# Altium schematic sheet ADC_Breakout.SchDoc
size A
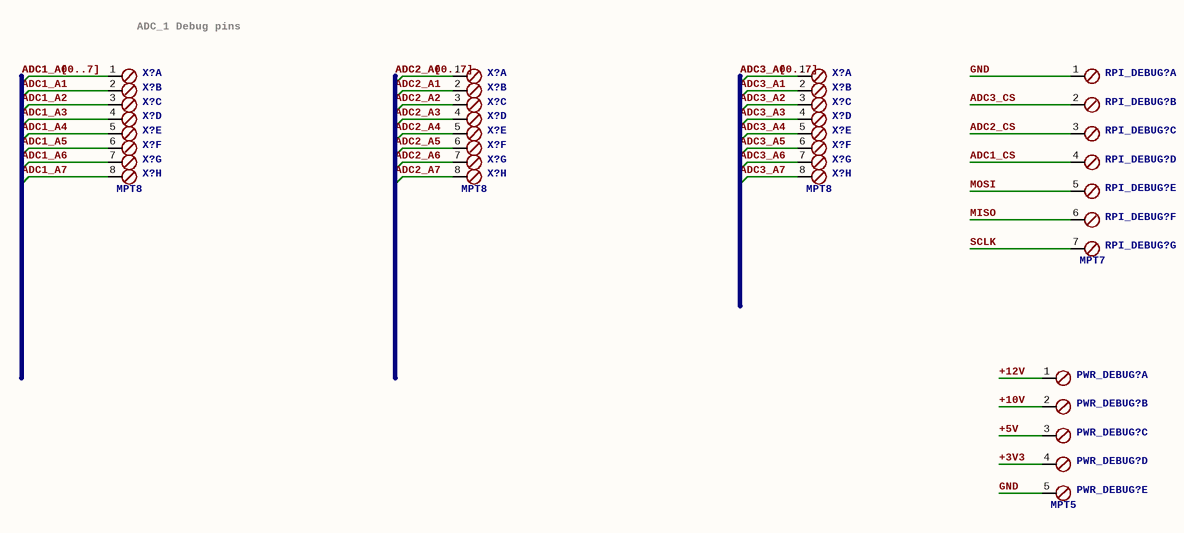
[diagram p0: ADC_Breakout.SchDoc]

## Parts
(Parts that share a designator on the sheet are numbered #1, #2 ... from top to bottom, then left to right.)
PWR_DEBUG?#1  MPT5  [5POL254]  (value not drawn)  (part A of 5)
PWR_DEBUG?#2  MPT5  [5POL254]  (value not drawn)  (part B of 5)
PWR_DEBUG?#3  MPT5  [5POL254]  (value not drawn)  (part C of 5)
PWR_DEBUG?#4  MPT5  [5POL254]  (value not drawn)  (part D of 5)
PWR_DEBUG?#5  MPT5  [5POL254]  (part E of 5)
RPI_DEBUG?#1  MPT7  [7POL254]  (value not drawn)  (part A of 7)
RPI_DEBUG?#2  MPT7  [7POL254]  (value not drawn)  (part B of 7)
RPI_DEBUG?#3  MPT7  [7POL254]  (value not drawn)  (part C of 7)
RPI_DEBUG?#4  MPT7  [7POL254]  (value not drawn)  (part D of 7)
RPI_DEBUG?#5  MPT7  [7POL254]  (value not drawn)  (part E of 7)
RPI_DEBUG?#6  MPT7  [7POL254]  (value not drawn)  (part F of 7)
RPI_DEBUG?#7  MPT7  [7POL254]  (part G of 7)
X?#1  MPT8  [8POL254]  (value not drawn)  (part A of 8)
X?#2  MPT8  [8POL254]  (value not drawn)  (part A of 8)
X?#3  MPT8  [8POL254]  (value not drawn)  (part A of 8)
X?#4  MPT8  [8POL254]  (value not drawn)  (part B of 8)
X?#5  MPT8  [8POL254]  (value not drawn)  (part B of 8)
X?#6  MPT8  [8POL254]  (value not drawn)  (part B of 8)
X?#7  MPT8  [8POL254]  (value not drawn)  (part C of 8)
X?#8  MPT8  [8POL254]  (value not drawn)  (part C of 8)
X?#9  MPT8  [8POL254]  (value not drawn)  (part C of 8)
X?#10  MPT8  [8POL254]  (value not drawn)  (part D of 8)
X?#11  MPT8  [8POL254]  (value not drawn)  (part D of 8)
X?#12  MPT8  [8POL254]  (value not drawn)  (part D of 8)
X?#13  MPT8  [8POL254]  (value not drawn)  (part E of 8)
X?#14  MPT8  [8POL254]  (value not drawn)  (part E of 8)
X?#15  MPT8  [8POL254]  (value not drawn)  (part E of 8)
X?#16  MPT8  [8POL254]  (value not drawn)  (part F of 8)
X?#17  MPT8  [8POL254]  (value not drawn)  (part F of 8)
X?#18  MPT8  [8POL254]  (value not drawn)  (part F of 8)
X?#19  MPT8  [8POL254]  (value not drawn)  (part G of 8)
X?#20  MPT8  [8POL254]  (value not drawn)  (part G of 8)
X?#21  MPT8  [8POL254]  (value not drawn)  (part G of 8)
X?#22  MPT8  [8POL254]  (part H of 8)
X?#23  MPT8  [8POL254]  (part H of 8)
X?#24  MPT8  [8POL254]  (part H of 8)

## Nets
+3V3: PWR_DEBUG?#4.4
+5V: PWR_DEBUG?#3.3
+10V: PWR_DEBUG?#2.2
+12V: PWR_DEBUG?#1.1
ADC1_CS: RPI_DEBUG?#4.4
ADC2_CS: RPI_DEBUG?#3.3
ADC3_CS: RPI_DEBUG?#2.2
GND: PWR_DEBUG?#5.5 RPI_DEBUG?#1.1
MISO: RPI_DEBUG?#6.6
MOSI: RPI_DEBUG?#5.5
SCLK: RPI_DEBUG?#7.7

Not connected (* = marked no-connect by the designer): X?#1 1; X?#2 1; X?#3 1; X?#4 2(1); X?#5 2(1); X?#6 2(1); X?#7 3(1); X?#8 3(1); X?#9 3(1); X?#10 4(1); X?#11 4(1); X?#12 4(1); X?#13 5(1); X?#14 5(1); X?#15 5(1); X?#16 6(1); X?#17 6(1); X?#18 6(1); X?#19 7(1); X?#20 7(1); X?#21 7(1); X?#22 8(1); X?#23 8(1); X?#24 8(1)

## Buses and harness runs
bus ADC1_A0 = ADC1_A1 = ADC1_A2 = ADC1_A3 = ADC1_A4 = ADC1_A5 = ADC1_A6 = ADC1_A7 = ADC1_A[0..7]
bus ADC2_A0 = ADC2_A1 = ADC2_A2 = ADC2_A3 = ADC2_A4 = ADC2_A5 = ADC2_A6 = ADC2_A7 = ADC2_A[0..7]
bus ADC3_A0 = ADC3_A1 = ADC3_A2 = ADC3_A3 = ADC3_A4 = ADC3_A5 = ADC3_A6 = ADC3_A7 = ADC3_A[0..7]

## Notes on the sheet
- (near X?#1) ADC_1 Debug pins

## Library data of the parts
PWR_DEBUG?#1-PWR_DEBUG?#5 = MPT5: PHOENIX CONNECTOR; GateName_1: -1; SymbolName_1: SKB; GateName_2: -2; GateName_3: -3; GateName_4: -4; GateName_5: -5; SymbolName_5: SKBV; SymbolName_2: SKB; SymbolName_3: SKB; SymbolName_4: SKB; LibraryName: con-phoenix-254; DeviceSetName: MPT5; MF: *; MPN: *; OC_FARNELL: unknown; OC_NEWARK: unknown
RPI_DEBUG?#1-RPI_DEBUG?#7 = MPT7: PHOENIX CONNECTOR; GateName_1: -1; SymbolName_1: SKB; GateName_2: -2; GateName_3: -3; GateName_4: -4; GateName_5: -5; GateName_6: -6; GateName_7: -7; SymbolName_7: SKBV; SymbolName_2: SKB; SymbolName_3: SKB; SymbolName_4: SKB; SymbolName_5: SKB; SymbolName_6: SKB; LibraryName: con-phoenix-254; DeviceSetName: MPT7; MF: *; MPN: *; OC_FARNELL: unknown; OC_NEWARK: unknown
X?#1-X?#24 = MPT8: PHOENIX CONNECTOR; GateName_1: -1; SymbolName_1: SKB; GateName_2: -2; GateName_3: -3; GateName_4: -4; GateName_5: -5; GateName_6: -6; GateName_7: -7; GateName_8: -8; SymbolName_8: SKBV; SymbolName_2: SKB; SymbolName_3: SKB; SymbolName_4: SKB; SymbolName_5: SKB; SymbolName_6: SKB; SymbolName_7: SKB; LibraryName: con-phoenix-254; DeviceSetName: MPT8; MF: *; MPN: *; OC_FARNELL: unknown; OC_NEWARK: unknown